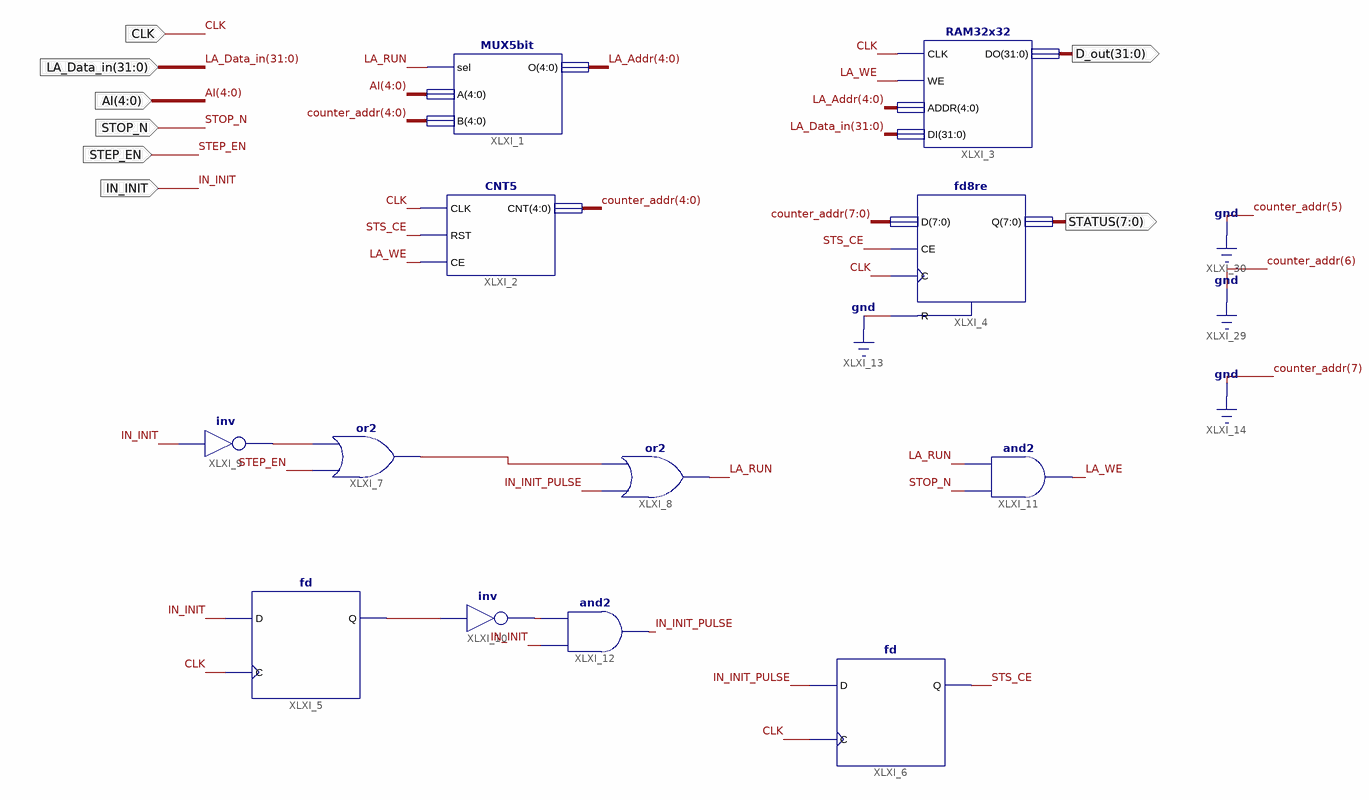
[diagram p0: schematic sheet 1]
// Xilinx ISE schematic Logic_Analyzer.sch (spartan6) as structural Verilog: 12 symbols, 8 ports
module Logic_Analyzer (
  input  CLK,
  input  [31:0] LA_Data_in,
  input  [4:0] AI,
  input  STOP_N,
  input  STEP_EN,
  input  IN_INIT,
  output [31:0] D_out,
  output [7:0] STATUS
);

  wire IN_INIT_PULSE, LA_RUN, LA_WE, STS_CE, XLXN_19, XLXN_20, XLXN_21, XLXN_30;
  wire [4:0] counter_addr, LA_Addr;

  MUX5bit XLXI_1 (.sel(LA_RUN), .A(AI), .B(counter_addr), .O(LA_Addr));
  CNT5 XLXI_2 (.CLK(CLK), .RST(STS_CE), .CE(LA_WE), .CNT(counter_addr));
  RAM32x32 XLXI_3 (.CLK(CLK), .WE(LA_WE), .ADDR(LA_Addr), .DI(LA_Data_in), .DO(D_out));
  fd8re XLXI_4 (.C(CLK), .CE(STS_CE), .D({3'b000, counter_addr}), .R(1'b0), .Q(STATUS));
  fd XLXI_5 (.C(CLK), .D(IN_INIT), .Q(XLXN_21));
  fd XLXI_6 (.C(CLK), .D(IN_INIT_PULSE), .Q(STS_CE));
  or XLXI_7 (XLXN_20, STEP_EN, XLXN_19);
  or XLXI_8 (LA_RUN, IN_INIT_PULSE, XLXN_20);
  not XLXI_9 (XLXN_19, IN_INIT);
  not XLXI_10 (XLXN_30, XLXN_21);
  and XLXI_11 (LA_WE, STOP_N, LA_RUN);
  and XLXI_12 (IN_INIT_PULSE, IN_INIT, XLXN_30);
endmodule
